# Altium schematic sheet [6]_PSU.SchDoc: PSU
size A4; DocumentNumber: 6; SheetNumber: 6; SheetTotal: 8
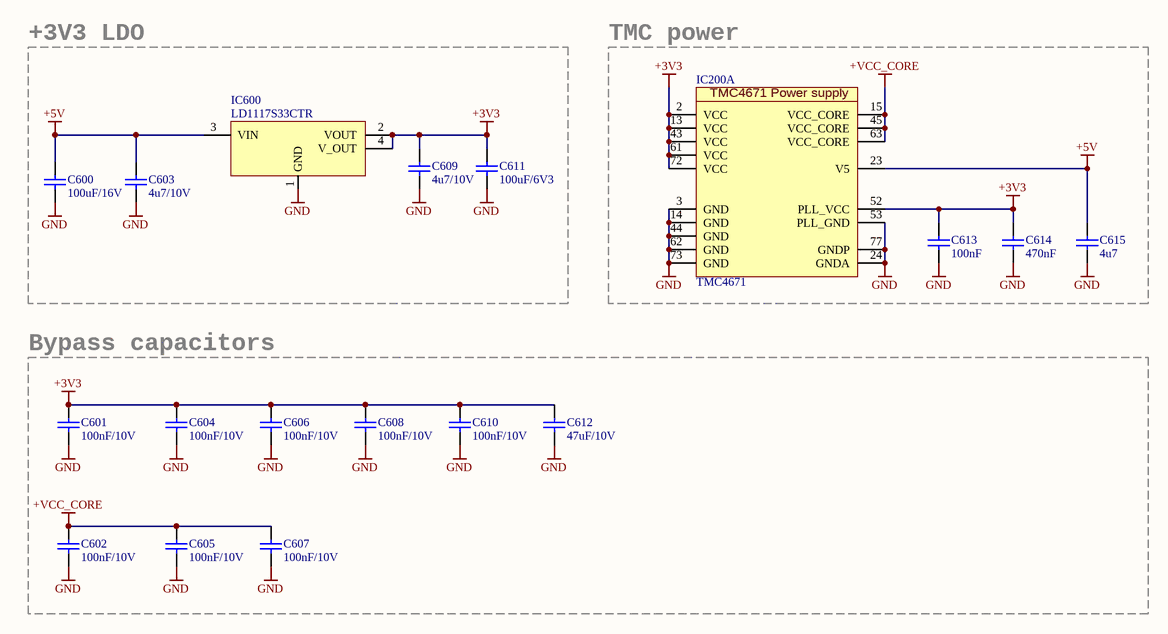
[diagram p0: [6]_PSU.SchDoc]

## Parts
C600  100uF/16V  [C1210]
C601  100nF/10V  [C0603]
C602  100nF/10V  [C0603]
C603  4u7/10V  [C0603]
C604  100nF/10V  [C0603]
C605  100nF/10V  [C0603]
C606  100nF/10V  [C0603]
C607  100nF/10V  [C0603]
C608  100nF/10V  [C0603]
C609  4u7/10V  [C0603]
C610  100nF/10V  [C0603]
C611  100uF/6V3  [C1210]
C612  47uF/10V  [C1206]
C613  100nF  [C0603]
C614  470nF  [C0603]
C615  4u7  [C0603]
IC200  TMC4671  [QFN40P1050X650X90_HS-77N]  (part A of 5)
IC600  LD1117S33CTR  [SOT230P700X180-4N]

## Blocks framed on the sheet
+3V3 LDO: C600 C603 C609 C611 IC600
TMC power: C613-C615 IC200
Bypass capacitors: C601 C602 C604-C608 C610 C612

## Nets
+3V3: C601.2 C604.2 C606.2 C608.2 C609.2 C610.2 C611.2 C612.2 C613.2 C614.1 IC200.2(VCC) IC200.13(VCC) IC200.43(VCC) IC200.52(PLL_VCC) IC200.61(VCC) IC200.72(VCC) IC600.2(VOUT) IC600.4(V_OUT)
+5V: C600.2 C603.2 C615.2 IC200.23(V5) IC600.3(VIN)
+VCC_CORE: C602.2 C605.2 C607.2 IC200.15(VCC_CORE) IC200.45(VCC_CORE) IC200.63(VCC_CORE)
GND: C600.1 C601.1 C602.1 C603.1 C604.1 C605.1 C606.1 C607.1 C608.1 C609.1 C610.1 C611.1 C612.1 C613.1 C614.2 C615.1 IC200.3(GND) IC200.14(GND) IC200.24(GNDA) IC200.44(GND) IC200.53(PLL_GND) IC200.62(GND) IC200.73(GND) IC200.77(GNDP) IC600.1(GND)

## Notes on the sheet
- Title:
- Size:
- Date:
- A4
- Project:
- Time:
- Sheet
- Version:
- of
- File:
- (in symbol TMC4671, part A) TMC4671 Power supply

## Library data of the parts
C600 = C, 100 µF, 16 V, ± 20%, X5R, M Series, 1210: SMD Multilayer Ceramic Capacitor, 1210 [3225 Metric], 100 µF, 16 V, ± 20%, X5R, M Series; MPN: EMK325ABJ107MM-T; Type: MLCC; VoltageRating: 16V; MF: TAIYO YUDEN; Capacitance: 100uF; Characteristic: X5R; Precision: 20%
C601 C602 C604-C608 C610 = C, 0.1 µF, 10 V, ± 10%, X7R, 0603: SMD Multilayer Ceramic Capacitor, 0603 [1608 Metric], 0.1 µF, 10 V, ± 10%, X7R, MC Series; MPN: MC0603B104K100CT; Type: MLCC; VoltageRating: 10V; MF: Multicomp; Capacitance: 100nF; Characteristic: X7R; ComponentLinknURL: *; Precision: 10%
C603 C609 = C, 4.7 µF, 10 V, ± 10%, X5R, MC Series , 0603: SMD Multilayer Ceramic Capacitor, 0603 [1608 Metric], 4.7 µF, 10 V, ± 10%, X5R, MC Series; MPN: MC0603X475K100CT; Type: MLCC; VoltageRating: 10V; MF: MULTICOMP; Capacitance: 4u7; Characteristic: X5R; Precision: 10%
C611 = C, 100 µF, 6.3 V, ± 20%, X5R, GRM Series, 1210: SMD Multilayer Ceramic Capacitor, 1210 [3225 Metric], 100 µF, 6.3 V, ± 20%, X5R, GRM Series; MPN: GRM31CR60J107ME39L.; Type: MLCC; VoltageRating: 6V3; MF: MURATA; Capacitance: 100uF; Characteristic: X5R; Precision: 20%
C612 = C, 47 µF, 10 V, ± 20%, X7R, MC Series , 1206: SMD Multilayer Ceramic Capacitor, 1206 [3216 Metric], 47 µF, 10 V, ± 20%, X5R, GRM Series; MPN: GRM31CR61A476ME15L; Type: MLCC; VoltageRating: 10V; MF: MURATA; Capacitance: 47uF; Characteristic: X5R; Precision: 20%
C613 = C, 0.1 µF, 10 V, ± 10%, X7R, 0603: SMD Multilayer Ceramic Capacitor, 0603 [1608 Metric], 0.1 µF, 10 V, ± 10%, X7R, MC Series; MPN: MC0603B104K100CT; Type: MLCC; VoltageRating: 10V; MF: Multicomp; Characteristic: X7R; ComponentLinknURL: *; Capacitance: 100nF; Precision: 10%
C614 = C, 0.47 µF, 16 V, ± 10%, X5R, MC Series, 0603 [1608 Metric]: SMD Multilayer Ceramic Capacitor, 0603 [1608 Metric], 0.47 µF, 16 V, ± 10%, X5R, MC Series; MPN: MC0603X474K160CT; Type: MLCC; Voltage rating: 16V; ComponentLinknDescription: Datasheet; MF: Multicomp; Characteristic: X5R; ComponentLinknURL: *; Capacitance: 470nF; Precision: 10%
C615 = C, 4.7 µF, 10 V, ± 10%, X5R, MC Series , 0603: SMD Multilayer Ceramic Capacitor, 0603 [1608 Metric], 4.7 µF, 10 V, ± 10%, X5R, MC Series; MPN: MC0603X475K100CT; Type: MLCC; VoltageRating: 10V; MF: MULTICOMP; Characteristic: X5R; Capacitance: 4u7; Precision: 10%
IC200 = TMC4671: MF: TRINAMIC; MPN: TMC4671
IC600 = LDO_LD1117S33CTR: Fixed LDO Voltage Regulator, 4.75V to 15V, 1.1V Dropout, 3.3Vout, 950mAout, SOT-223-4; MF: STMICROELECTRONICS; MPN: LD1117S33CTR